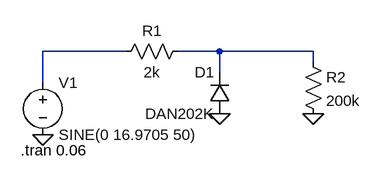
[diagram p0: schematic Negative Clipper.asc]
Negative Clipper.asc, the LTspice schematic file:
Version 4
SHEET 1 880 680
WIRE 128 32 0 32
WIRE 272 32 208 32
WIRE 416 32 272 32
WIRE 416 48 416 32
WIRE 272 64 272 32
WIRE 0 80 0 32
FLAG 416 128 0
FLAG 272 128 0
FLAG 0 160 0
SYMBOL res 224 16 R90
WINDOW 0 0 56 VBottom 2
WINDOW 3 32 56 VTop 2
SYMATTR InstName R1
SYMATTR Value 2k
SYMBOL res 400 32 R0
SYMATTR InstName R2
SYMATTR Value 200k
SYMBOL voltage 0 64 R0
WINDOW 123 0 0 Left 0
WINDOW 39 0 0 Left 0
SYMATTR InstName V1
SYMATTR Value SINE(0 16.9705 50)
SYMBOL diode 288 128 R180
WINDOW 0 24 64 Left 2
WINDOW 3 24 0 Left 2
SYMATTR InstName D1
SYMATTR Value DAN202K
TEXT -34 184 Left 2 !.tran 0.06

The netlist it stands for:
* Negative Clipper.asc
R1 N002 N001 2k
R2 N002 0 200k
V1 N001 0 SINE(0 16.9705 50)
D1 0 N002 DAN202K
.model D D
.lib standard.dio
.tran 0.06
.backanno
.end